# Altium schematic sheet Power Input and Regulators.SchDoc
size A4; Author: Vishal Y. Bajaj; SheetNumber: 11; SheetTotal: 11; Scale: 1:1; Template: A4
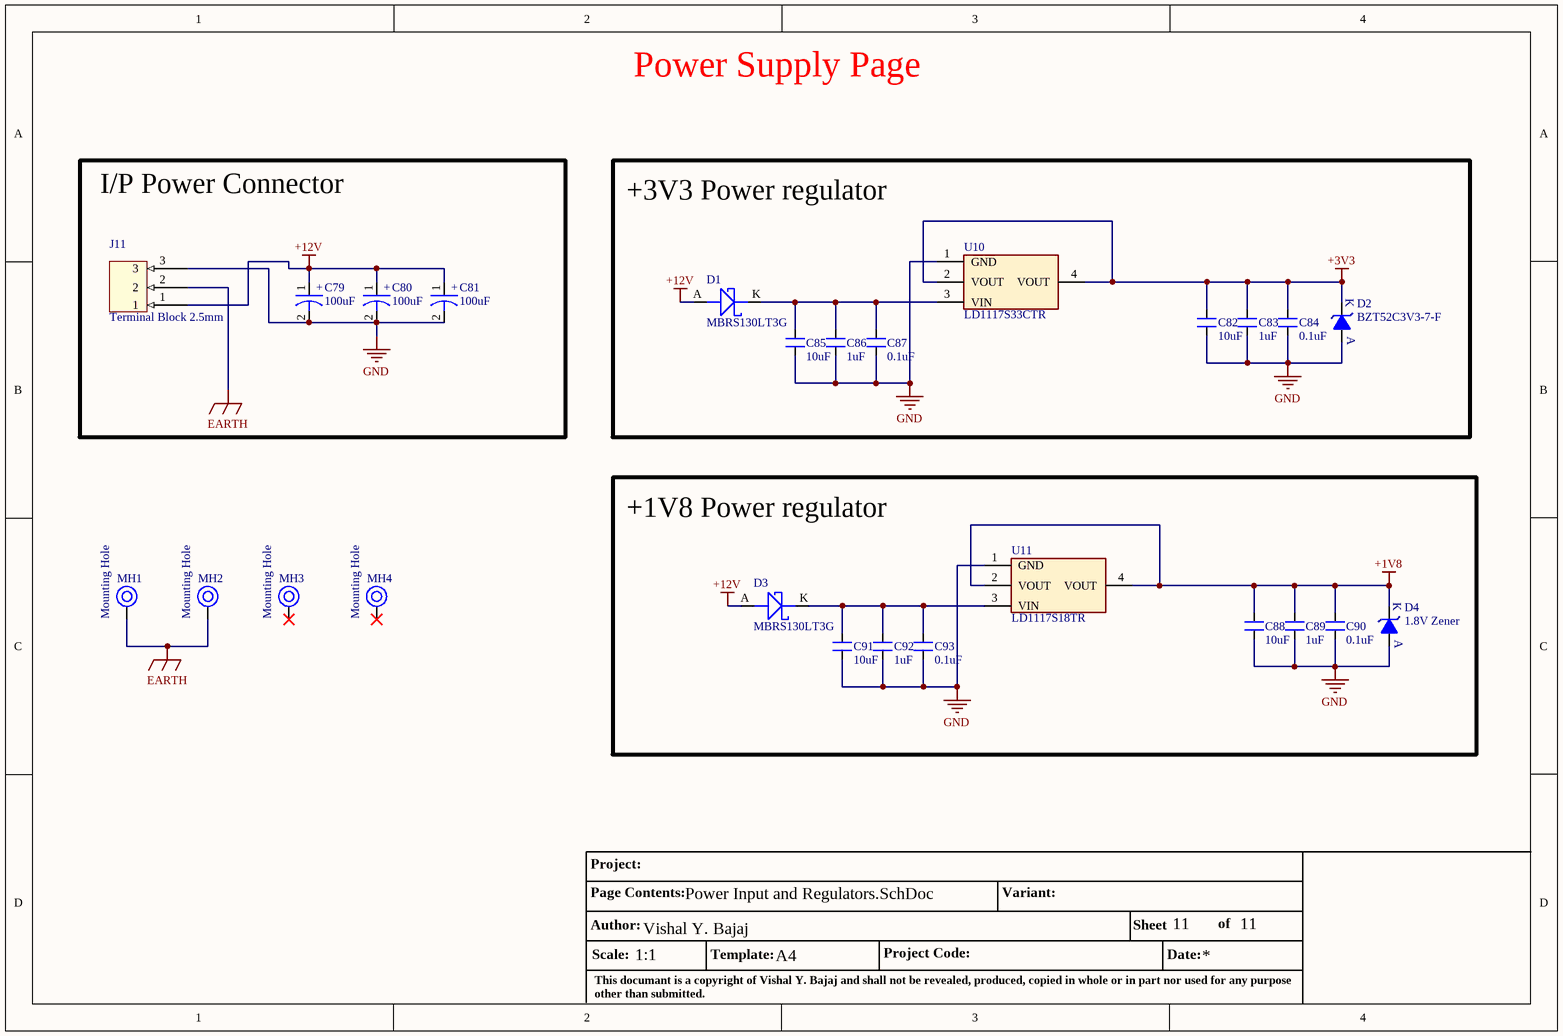
[diagram p0: Power Input and Regulators.SchDoc]

## Parts
C79  100uF  [ACAP_P305_D393_H393_RAD]
C80  100uF  [ACAP_P305_D393_H393_RAD]
C81  100uF  [ACAP_P305_D393_H393_RAD]
C82  10uF  [CAP_1206]
C83  1uF  [CAP_0805]
C84  0.1uF  [CAP_0805]
C85  10uF  [CAP_1206]
C86  1uF  [CAP_0805]
C87  0.1uF  [CAP_0805]
C88  10uF  [CAP_1206]
C89  1uF  [CAP_0805]
C90  0.1uF  [CAP_0805]
C91  10uF  [CAP_1206]
C92  1uF  [CAP_0805]
C93  0.1uF  [CAP_0805]
D1  MBRS130LT3G  [DIO_SMB_DO-214AA]
D2  BZT52C3V3-7-F  [DIO_SOD-123]
D3  MBRS130LT3G  [DIO_SMB_DO-214AA]
D4  1.8V Zener  [DIO_DO-213AB_SMD]
J11  Terminal Block 2.5mm  [CON3_100_TB_TH_ST]
MH1  Mounting Hole  [MOUNTING]
MH2  Mounting Hole  [MOUNTING]
MH3  Mounting Hole  [MOUNTING]
MH4  Mounting Hole  [MOUNTING]
U10  LD1117S33CTR  [SOT223_3]
U11  LD1117S18TR  [SOT223_3]

## Blocks framed on the sheet
I/P Power Connector: C79-C81 J11
+3V3 Power regulator: C82-C87 D1 D2 U10
+1V8 Power regulator: C88-C93 D3 D4 U11

## Nets
+1V8: C88.2 C89.2 C90.2 D4.K U11.2(VOUT) U11.4(VOUT)
+3V3: C82.2 C83.2 C84.2 D2.K U10.2(VOUT) U10.4(VOUT)
+12V: C79.1 C80.1 C81.1 D1.A D3.A J11.1
EARTH: J11.2 MH1.1 MH2.1
GND: C79.2 C80.2 C81.2 C82.1 C83.1 C84.1 C85.1 C86.1 C87.1 C88.1 C89.1 C90.1 C91.1 C92.1 C93.1 D2.A D4.A J11.3 U10.1(GND) U11.1(GND)
NetC85_2: C85.2 C86.2 C87.2 D1.K U10.3(VIN)
NetC91_2: C91.2 C92.2 C93.2 D3.K U11.3(VIN)

Not connected (* = marked no-connect by the designer): MH3 1*; MH4 1*

## Notes on the sheet
- Power Supply Page
- Project:
- Page Contents:
- Variant:
- Author:
- Scale:
- Template:
- Project Code:
- Sheet
- Date:
- of
- This documant is a copyright of Vishal Y. Bajaj and shall not be revealed, produced, copied in whole or in part nor used for any purpose
  other than submitted.
- (in symbol CAP-P_100uF-50V-20%-RAD) +

## Library data of the parts
C79-C81 = CAP-P_100uF-50V-20%-RAD: 100µF 50V Aluminum Polymer Capacitor Radial, Can - SMD 28mOhm 4000 Hrs @ 125°C /; Manufacturer: Nichicon; Manufacturer Part Number: GYA1H101MCQ1GS; Alternate Part Number-1: VEU101M1HTR-1010; Case/Package: Radial-SMD; Supplier-1: SP ROAD; Supplier Part Number-1: GYA1H101MCQ1GS
C82 C85 C88 C91 = CAP_10uF-50V-10%-1206: 10µF ±10% 50V Ceramic Capacitor X7R 1206 (3216 Metric) /; Manufacturer: KEMET; Manufacturer Part Number: CL31B106KBHNNNE; Alternate Part Number-1: GRT31CR61H106ME01L; Case/Package: 1206; Supplier-1: SIRICOM; Supplier Part Number-1: CC1206KKX5R9BB106
C83 C86 C89 C92 = CAP_1uF-50V-5%-0805: 1µF ±5% 50V Ceramic Capacitor X7R 0805 (2012 Metric) /; Manufacturer: Samsung; Manufacturer Part Number: CC0805JKX7R9BB105; Alternate Part Number-1: 0805F105M500NT; Case/Package: 0805; Supplier-1: SIRICOM; Supplier Part Number-1: CL21B105KBFNNNE
C84 C87 C90 C93 = CAP_0.1uF-50V-10%-0805: 0.1µF ±10% 50V Ceramic Capacitor X7R 0805 (2012 Metric) /; Manufacturer: Samsung; Manufacturer Part Number: CL21B104KBCNNNC; Alternate Part Number-1: NA; Case/Package: 0805; Supplier-1: SIRICOM; Supplier Part Number-1: 0805B104K500CT
D1 D3 = DIO-S_445mV-30V-2A-SMB: Diode Schottky 30V 2A Surface Mount SMB; Manufacturer: ON Semiconductor; Alternate Part Number-1: NA; Manufacturer Part Number: MBRS130LT3G; Case/Package: SMB; Supplier-1: ARROW; Supplier Part Number-1: MBRS130LT3G
D2 = DIO-Z_3.3V-500mW-SOD123: Zener Diode 3.3V 500mW ±6% Surface Mount SOD-123 /; Manufacturer: Diodes Incorporated; Alternate Part Number-1: NA; Manufacturer Part Number: BZT52C3V3-7-F; Case/Package: SOD-123; Supplier-1: Digikey; Supplier Part Number-1: BZT52C3V3-FDICT-ND
D4 = DIO-Z_1.8V-500mW-DO213AA: Zener Diode 1.8V 500mW ±5% Surface Mount DO-213AA /; Manufacturer: *; Manufacturer Part Number: *; Case/Package: *; Supplier-1: *; Supplier Part Number-1: *; Alternate Part Number-1: *
J11 = CON-TB_3X1-100-ST-TH: 3 Pins, 1 Row 2.54mm Pitch, straight Connector, male; Manufacturer Part Number: 1725669; Manufacturer: Phoenix Contact; Alternate Part Number-1: NA; Case/Package: TH-CON; Supplier-1: SP ROAD; Supplier Part Number-1: 1725669
MH1-MH4 = MH_3.5H_6D: Manufacturer Part Number: NA; Case/Package: TH; Manufacturer: NA; Supplier-1: NA; Supplier Part Number-1: NA; Alternate Part Number-1: NA
U10 = REG_15V-3.3V-0.9A-12W-SOT223: Linear Voltage Regulator IC 1 Output 800mA SOT-223; Manufacturer: STMicroelectronics; Alternate Part Number-1: NA; Manufacturer Part Number: LD1117S33CTR; Case/Package: SOT223; Supplier-1: SP ROAD; Supplier Part Number-1: LD1117S33CTR
U11 = REG_15V-1.8V-0.8A-1.4W-SOT223: LDO Voltage Regulators 1.8V 0.8A Positive; Manufacturer: STMicroelectronics; Alternate Part Number-1: NA; Manufacturer Part Number: LD1117S18TR; Case/Package: SOT-223-3; Supplier-1: Mouser; Supplier Part Number-1: 511-LD1117S18-TR